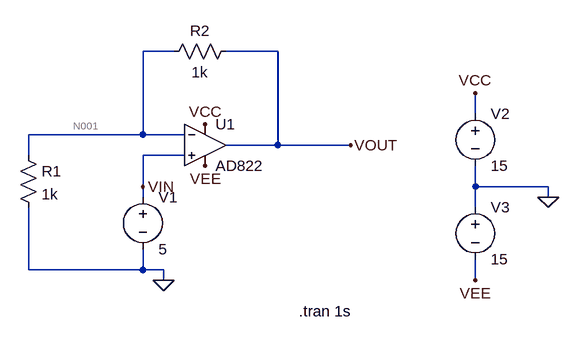
[diagram p0: schematic Test_Non_Inverting_Amplifier.asc]
Test_Non_Inverting_Amplifier.asc, the LTspice schematic file:
Version 4
SHEET 1 880 680
WIRE 96 -16 48 -16
WIRE 256 -16 176 -16
WIRE 560 80 560 48
WIRE 48 112 48 -16
WIRE 48 112 -128 112
WIRE 112 112 48 112
WIRE 256 128 256 -16
WIRE 256 128 176 128
WIRE 368 128 256 128
WIRE -128 144 -128 112
WIRE 112 144 48 144
WIRE 48 192 48 144
WIRE 560 192 560 160
WIRE 672 192 560 192
WIRE 48 208 48 192
WIRE 672 208 672 192
WIRE 560 224 560 192
WIRE -128 320 -128 224
WIRE 48 320 48 288
WIRE 48 320 -128 320
WIRE 80 320 48 320
WIRE 80 336 80 320
WIRE 560 336 560 304
FLAG 80 336 0
FLAG 672 208 0
FLAG 560 48 VCC
FLAG 560 336 VEE
FLAG 144 96 VCC
FLAG 144 160 VEE
FLAG 368 128 VOUT
FLAG 48 192 VIN
SYMBOL AD822 144 64 R0
SYMATTR InstName U1
SYMBOL res -144 128 R0
SYMATTR InstName R1
SYMATTR Value 1k
SYMBOL res 192 -32 R90
WINDOW 0 0 56 VBottom 2
WINDOW 3 32 56 VTop 2
SYMATTR InstName R2
SYMATTR Value 1k
SYMBOL voltage 48 192 R0
SYMATTR InstName V1
SYMATTR Value 5
SYMBOL voltage 560 64 R0
SYMATTR InstName V2
SYMATTR Value 15
SYMBOL voltage 560 208 R0
WINDOW 123 0 0 Left 0
WINDOW 39 0 0 Left 0
SYMATTR InstName V3
SYMATTR Value 15
TEXT 288 384 Left 2 !.tran 1s

The netlist it stands for:
* Test_Non_Inverting_Amplifier.asc
* U1: AD822 (symbol AD822 not available, pins judged from their places): In+=VIN In-=N001 V+=VCC V-=VEE OUT=VOUT
R1 N001 0 1k
R2 VOUT N001 1k
V1 VIN 0 5
V2 VCC 0 15
V3 0 VEE 15
.tran 1s
.backanno
.end

* Results of the author's LTspice run, read from the files saved beside the schematic
* Operating Point, zero values left out:
*   V(vcc) = 15 V
*   V(vee) = -15 V
*   V(n001) = 5 V
*   V(vin) = 5 V
*   V(vout) = 10 V
*   I(R2) = 5 mA
*   I(R1) = 5 mA
*   I(V3) = -712.6 µA
*   I(V2) = -5.713 mA
*   I(V1) = -2.25 pA
*   Ix(u1:1) = 2.25 pA
*   Ix(u1:2) = 2.25 pA
*   Ix(u1:3) = 5.713 mA
*   Ix(u1:4) = -712.6 µA
*   Ix(u1:5) = -5 mA